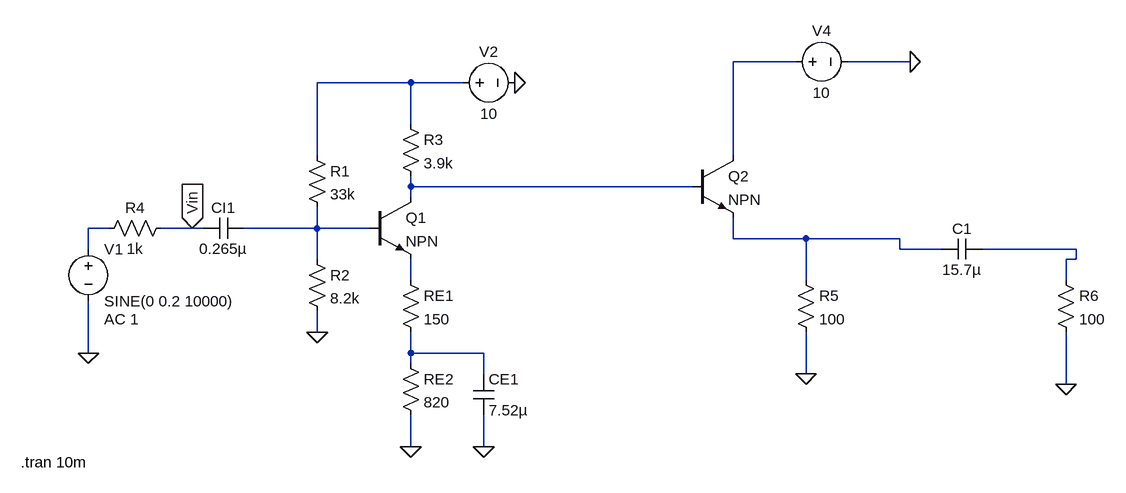
[diagram p0: schematic ELE344_Lab2.asc]
ELE344_Lab2.asc, the LTspice schematic file:
Version 4
SHEET 1 1492 680
WIRE 768 -192 672 -192
WIRE 944 -192 848 -192
WIRE 176 -160 32 -160
WIRE 256 -160 176 -160
WIRE 176 -96 176 -160
WIRE 32 -48 32 -160
WIRE 672 -48 672 -192
WIRE 176 0 176 -16
WIRE 608 0 176 0
WIRE 176 16 176 0
WIRE -288 64 -320 64
WIRE -160 64 -208 64
WIRE -144 64 -160 64
WIRE 32 64 32 32
WIRE 32 64 -80 64
WIRE 112 64 32 64
WIRE 672 80 672 48
WIRE 784 80 672 80
WIRE 928 80 784 80
WIRE -320 96 -320 64
WIRE 928 96 928 80
WIRE 992 96 928 96
WIRE 1200 96 1056 96
WIRE 32 112 32 64
WIRE 1200 112 1200 96
WIRE 1200 112 1184 112
WIRE 176 144 176 112
WIRE 784 144 784 80
WIRE 1184 144 1184 112
WIRE 32 224 32 192
WIRE -320 256 -320 176
WIRE 176 256 176 224
WIRE 288 256 176 256
WIRE 176 272 176 256
WIRE 288 288 288 256
WIRE 784 288 784 224
WIRE 1184 304 1184 224
WIRE 176 400 176 352
WIRE 288 400 288 352
FLAG -320 256 0
FLAG 176 400 0
FLAG 288 400 0
FLAG 32 224 0
FLAG 336 -160 0
FLAG -160 64 Vin
IOPIN -160 64 In
FLAG 784 288 0
FLAG 1184 304 0
FLAG 944 -192 0
SYMBOL res 16 -64 R0
SYMATTR InstName R1
SYMATTR Value 33k
SYMBOL res 16 96 R0
SYMATTR InstName R2
SYMATTR Value 8.2k
SYMBOL voltage -320 80 R0
WINDOW 123 24 124 Left 2
WINDOW 39 0 0 Left 0
SYMATTR Value2 AC 1
SYMATTR InstName V1
SYMATTR Value SINE(0 0.2 10000)
SYMBOL cap -80 48 R90
WINDOW 0 0 32 VBottom 2
WINDOW 3 32 32 VTop 2
SYMATTR InstName CI1
SYMATTR Value 0.265µ
SYMBOL res 160 -112 R0
SYMATTR InstName R3
SYMATTR Value 3.9k
SYMBOL res 160 128 R0
SYMATTR InstName RE1
SYMATTR Value 150
SYMBOL res 160 256 R0
SYMATTR InstName RE2
SYMATTR Value 820
SYMBOL cap 272 288 R0
SYMATTR InstName CE1
SYMATTR Value 7.52µ
SYMBOL npn 112 16 R0
SYMATTR InstName Q1
SYMBOL voltage 240 -160 R270
WINDOW 0 32 56 VTop 2
WINDOW 3 -32 56 VBottom 2
WINDOW 123 0 0 Left 0
WINDOW 39 0 0 Left 0
SYMATTR InstName V2
SYMATTR Value 10
SYMBOL npn 608 -48 R0
SYMATTR InstName Q2
SYMBOL res 768 128 R0
SYMATTR InstName R5
SYMATTR Value 100
SYMBOL voltage 752 -192 R270
WINDOW 0 32 56 VTop 2
WINDOW 3 -32 56 VBottom 2
WINDOW 123 0 0 Left 0
WINDOW 39 0 0 Left 0
SYMATTR InstName V4
SYMATTR Value 10
SYMBOL cap 1056 80 R90
WINDOW 0 0 32 VBottom 2
WINDOW 3 32 32 VTop 2
SYMATTR InstName C1
SYMATTR Value 15.7µ
SYMBOL res 1168 128 R0
SYMATTR InstName R6
SYMATTR Value 100
SYMBOL res -192 48 R90
WINDOW 0 0 56 VBottom 2
WINDOW 3 32 56 VTop 2
SYMATTR InstName R4
SYMATTR Value 1k
TEXT -424 424 Left 2 !.tran 10m

The netlist it stands for:
* ELE344_Lab2.asc
R1 N002 N005 33k
R2 N005 0 8.2k
V1 N004 0 SINE(0 0.2 10000) AC 1
CI1 N005 Vin 0.265µ
R3 N002 N003 3.9k
RE1 N008 N009 150
RE2 N009 0 820
CE1 N009 0 7.52µ
Q1 N003 N005 N008 0 NPN
V2 N002 0 10
Q2 N001 N003 N006 0 NPN
R5 N006 0 100
V4 N001 0 10
C1 N007 N006 15.7µ
R6 N007 0 100
R4 Vin N004 1k
.model NPN NPN
.model PNP PNP
.lib standard.bjt
.tran 10m
.backanno
.end